# Altium schematic sheet BLDC.SchDoc
size A3
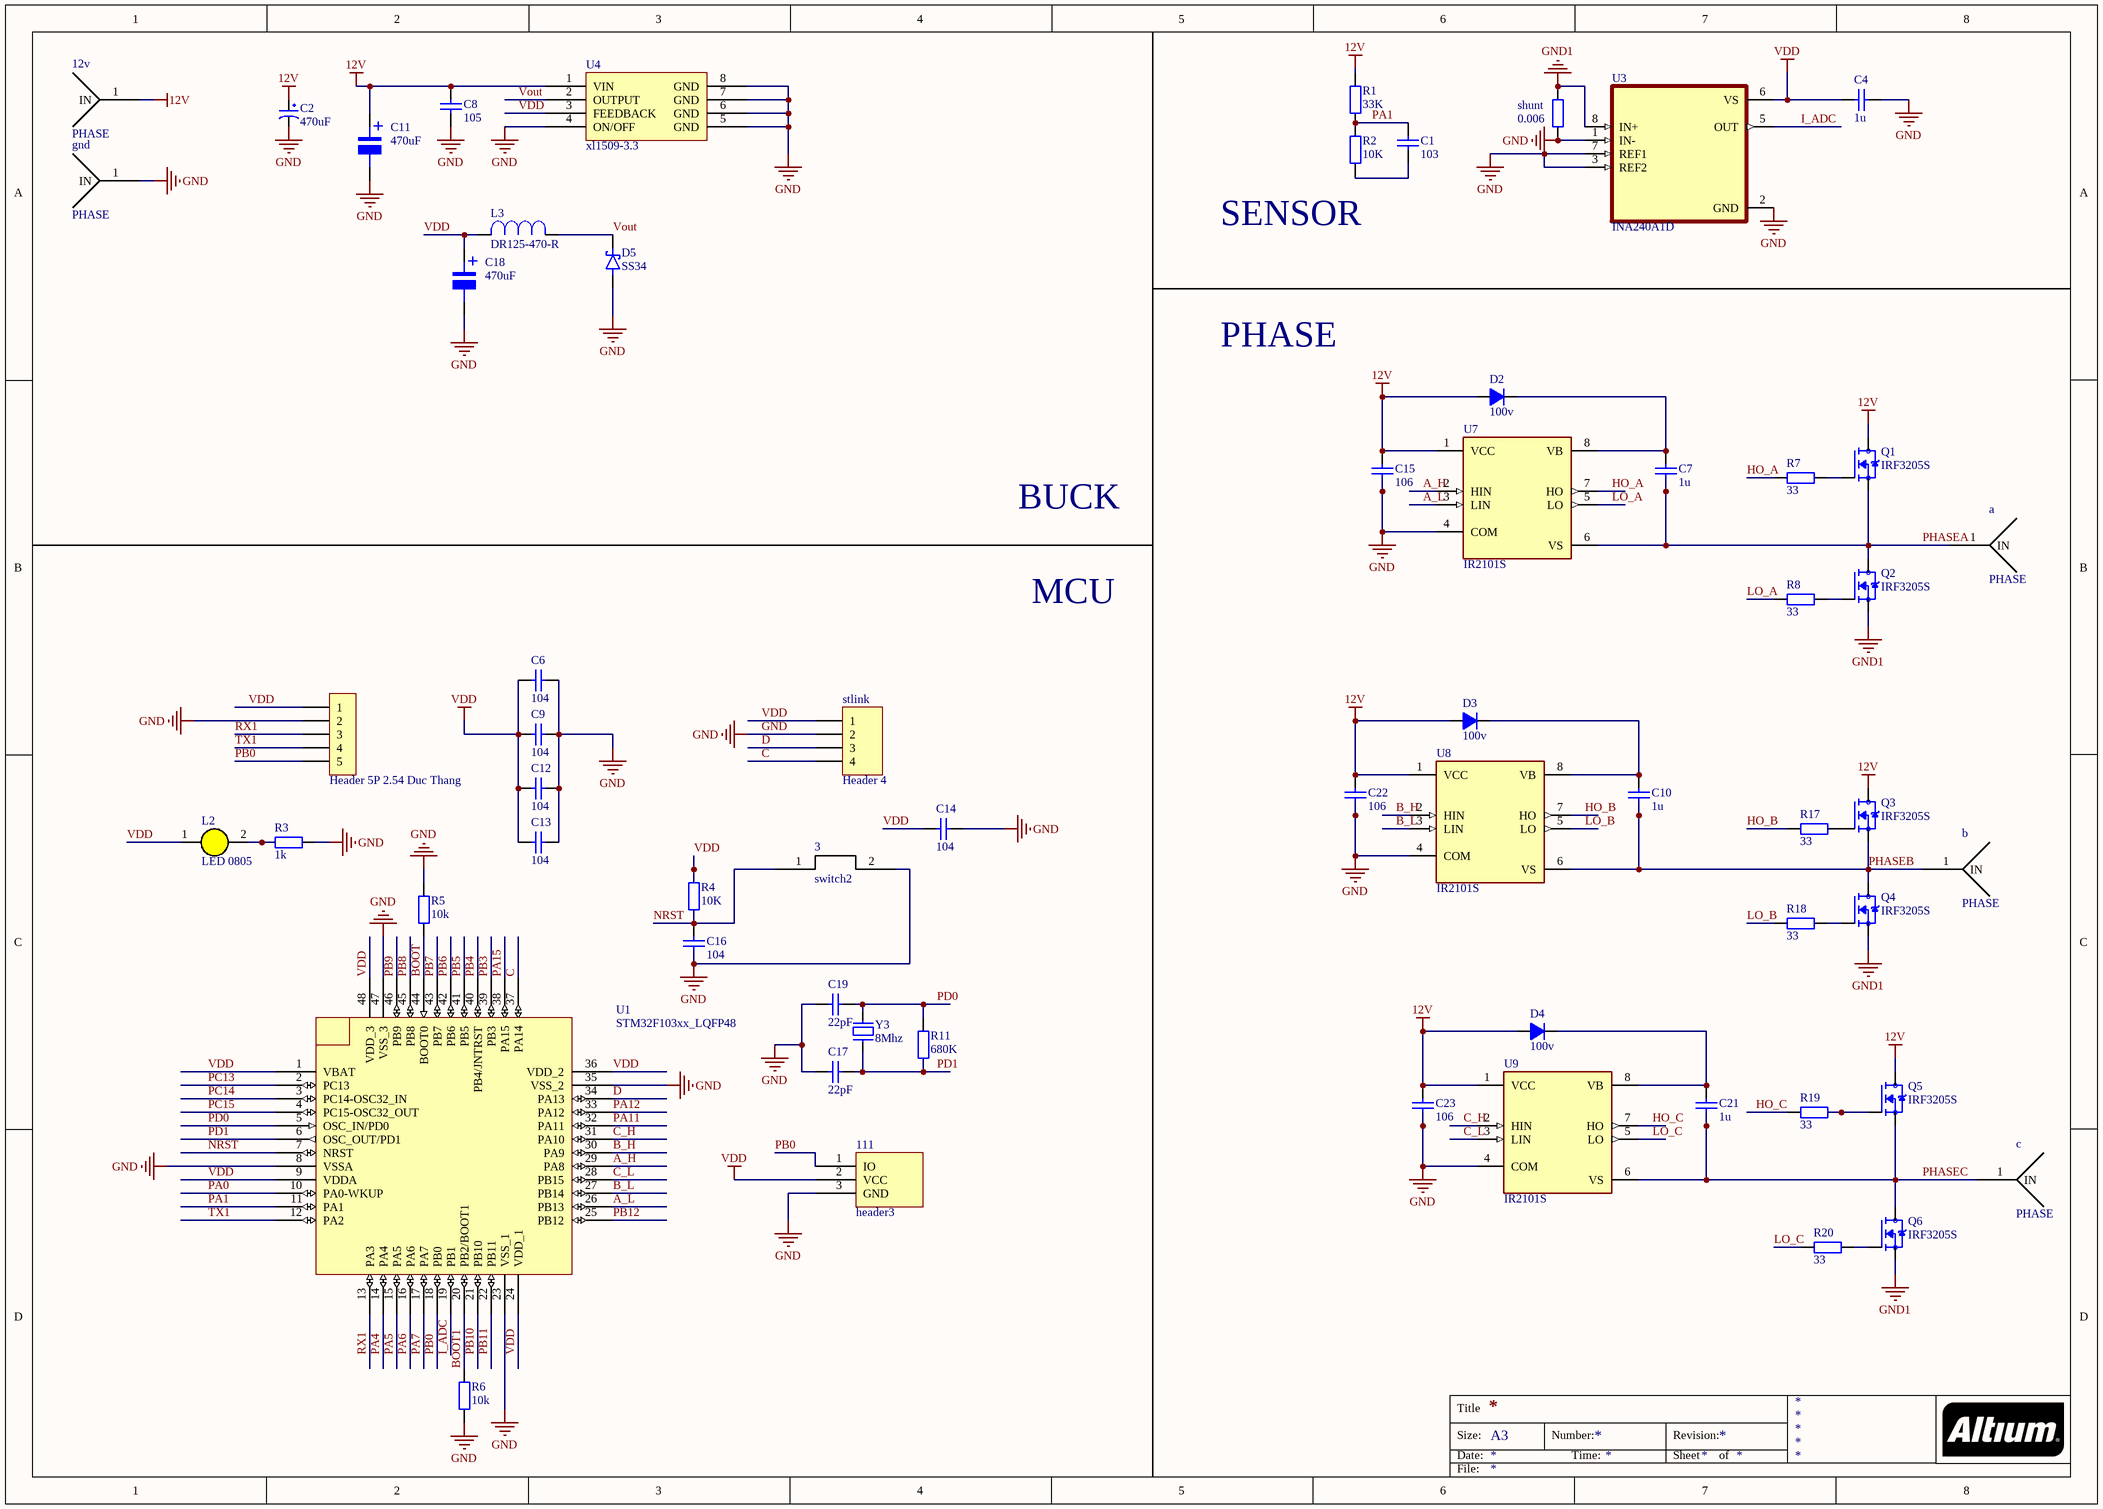
[diagram p0: BLDC.SchDoc]

## Parts
3  switch2  [switch]
12v  PHASE  [PCBComponent_1 - duplicate]
111  header3  [Edge Connector]
a  PHASE  [PCBComponent_1 - duplicate]
b  PHASE  [PCBComponent_1 - duplicate]
c  PHASE  [PCBComponent_1 - duplicate]
C1  103  [tu 0805]
C2  470uF  [TU HOA 10mm]
C4  1u  [tu 0805]
C6  104  [tu 0805]
C7  1u  [tu 0805]
C8  105  [tu 0805]
C9  104  [tu 0805]
C10  1u  [tu 0805]
C11  470uF  [tu nhom 8 (f)]
C12  104  [tu 0805]
C13  104  [tu 0805]
C14  104  [tu 0805]
C15  106  [tu 0805]
C16  104  [tu 0805]
C17  22pF  [tu 0805]
C18  470uF  [tu nhom 8 (f)]
C19  22pF  [tu 0805]
C21  1u  [tu 0805]
C22  106  [tu 0805]
C23  106  [tu 0805]
D2  100v  [DIODE 0.5A]
D3  100v  [DIODE 0.5A]
D4  100v  [DIODE 0.5A]
D5  SS34  [DIOM794X590X250]
gnd  PHASE  [PCBComponent_1 - duplicate]
H1  Header 5P 2.54 Duc Thang  [XH2.54M-5]
L2  LED 0805  [LED-0805-Yellow]
L3  DR125-470-R  [INDM125125X600N]
Q1  IRF3205S  [TRANS_IRF3205S]
Q2  IRF3205S  [TRANS_IRF3205S]
Q3  IRF3205S  [TRANS_IRF3205S]
Q4  IRF3205S  [TRANS_IRF3205S]
Q5  IRF3205S  [TRANS_IRF3205S]
Q6  IRF3205S  [TRANS_IRF3205S]
R1  33K  [tro smd 0805]
R2  10K  [tro smd 0805]
R3  1k  [tro smd 0805]
R4  10K  [tro smd 0805]
R5  10k  [tro smd 0805]
R6  10k  [tro smd 0805]
R7  33  [tro smd 0805]
R8  33  [tro smd 0805]
R11  680K  [tro smd 0805]
R17  33  [tro smd 0805]
R18  33  [tro smd 0805]
R19  33  [tro smd 0805]
R20  33  [tro smd 0805]
shunt  0.006  [PCBComponent_1]
stlink  Header 4  [HDR1X4]
U1  STM32F103xx_LQFP48  [STM32_LQPF48]
U3  INA240A1D  [SOIC127P599X175-8N]
U4  xl1509-3.3  [BUCK-3.3]
U7  IR2101S  [SOIC127P600X175-8N]
U8  IR2101S  [SOIC127P600X175-8N]
U9  IR2101S  [SOIC127P600X175-8N]
Y3  8Mhz  [Thach Anh 2 chan SMD5032]

## Nets
12V: 12v.1(IN) C2.1 C8.1 C11.1 C15.1 C22.1 C23.1 D2.1(A) D3.1(A) D4.1(A) Q1.2(D) Q3.2(D) Q5.2(D) R1.1 U4.1(VIN) U7.1(VCC) U8.1(VCC) U9.1(VCC)
GND: 3.2 111.3(GND) C2.2 C4.2 C6.2 C8.2 C9.2 C11.2 C12.2 C13.2 C14.2 C15.2 C16.1 C17.1 C18.2 C19.2 C22.2 C23.2 D5.A gnd.1(IN) H1.2 R3.2 R5.2 R6.1 shunt.1 stlink.2 U1.8(VSSA) U1.23(VSS_1) U1.35(VSS_2) U1.47(VSS_3) U3.1(IN-) U3.2(GND) U3.3(REF2) U3.7(REF1) U4.4(ON/OFF) U4.5(GND) U4.6(GND) U4.7(GND) U4.8(GND) U7.4(COM) U8.4(COM) U9.4(COM)
GND1: Q2.3(S) Q4.3(S) Q6.3(S) shunt.2 U3.8(IN+)
VDD: 111.2(VCC) C4.1 C6.1 C9.1 C12.1 C13.1 C14.1 C18.1 H1.1 L2.1(A) L3.2 R4.1 stlink.1 U1.1(VBAT) U1.9(VDDA) U1.24(VDD_1) U1.36(VDD_2) U1.48(VDD_3) U3.6(VS) U4.3(FEEDBACK)
A_H: U1.29(PA8) U7.2(HIN)
A_L: U1.26(PB13) U7.3(LIN)
B_H: U1.30(PA9) U8.2(HIN)
B_L: U1.27(PB14) U8.3(LIN)
BOOT: R5.1 U1.44(BOOT0)
BOOT1: R6.2 U1.20(PB2/BOOT1)
C: stlink.4 U1.37(PA14)
C_H: U1.31(PA10) U9.2(HIN)
C_L: U1.28(PB15) U9.3(LIN)
D: stlink.3 U1.34(PA13)
HO_A: R7.1 U7.7(HO)
HO_B: R17.1 U8.7(HO)
HO_C: R19.1 U9.7(HO)
I_ADC: U1.19(PB1) U3.5(OUT)
LO_A: R8.1 U7.5(LO)
LO_B: R18.1 U8.5(LO)
LO_C: R20.1 U9.5(LO)
NRST: 3.1 C16.2 R4.2 U1.7(NRST)
PA0: U1.10(PA0-WKUP)
PA1: C1.1 R1.2 R2.1 U1.11(PA1)
PA4: U1.14(PA4)
PA5: U1.15(PA5)
PA6: U1.16(PA6)
PA7: U1.17(PA7)
PA11: U1.32(PA11)
PA12: U1.33(PA12)
PA15: U1.38(PA15)
PB0: 111.1(IO) H1.5 U1.18(PB0)
PB3: U1.39(PB3)
PB4: U1.40(PB4/JNTRST)
PB5: U1.41(PB5)
PB6: U1.42(PB6)
PB7: U1.43(PB7)
PB8: U1.45(PB8)
PB9: U1.46(PB9)
PB10: U1.21(PB10)
PB11: U1.22(PB11)
PB12: U1.25(PB12)
PC13: U1.2(PC13)
PC14: U1.3(PC14-OSC32_IN)
PC15: U1.4(PC15-OSC32_OUT)
PD0: C19.1 R11.2 U1.5(OSC_IN/PD0) Y3.2
PD1: C17.2 R11.1 U1.6(OSC_OUT/PD1) Y3.1
PHASEA: a.1(IN) C7.2 Q1.3(S) Q2.2(D) U7.6(VS)
PHASEB: b.1(IN) C10.2 Q3.3(S) Q4.2(D) U8.6(VS)
PHASEC: c.1(IN) C21.2 Q5.3(S) Q6.2(D) U9.6(VS)
RX1: H1.3 U1.13(PA3)
TX1: H1.4 U1.12(PA2)
Vout: D5.C L3.1 U4.2(OUTPUT)
NetC1_2: C1.2 R2.2
NetC7_1: C7.1 D2.2(K) U7.8(VB)
NetC10_1: C10.1 D3.2(K) U8.8(VB)
NetC21_1: C21.1 D4.2(K) U9.8(VB)
NetL2_2: L2.2(K) R3.1
NetQ1_1: Q1.1(G) R7.2
NetQ2_1: Q2.1(G) R8.2
NetQ3_1: Q3.1(G) R17.2
NetQ4_1: Q4.1(G) R18.2
NetQ5_1: Q5.1(G) R19.2
NetQ6_1: Q6.1(G) R20.2

## Notes on the sheet
- (near R2) SENSOR
- PHASE
- BUCK
- MCU
- Title
- Size:
- Date:
- A3
- Number:
- Time:
- Revision:
- Sheet
- of
- File:
- (in symbol Tu Nhom 470uF 16V) +

## Library data of the parts
C1 = Tu 0805 22nF 50V 20%: Dán; Don_Vi: Con; So_Chan: 2; Ten_Linh_Kien: Tụ 0805 22nF 50V 20%; Ma_Hang: MH007857; Chung_Loai: Dán; Kieu_Chan: *
C2 = Tu Hoa 470uF 6.3V 8x11: Cắm; Don_Vi: Con; So_Chan: 2; Ten_Linh_Kien: Tụ Hóa 470uF 6.3V 8x11MM; Ma_Hang: MH004511; Chung_Loai: Cắm; Kieu_Chan: *
C4 C6 C9 C12-C17 C22 C23 = Tu 0805 106 16V 10%: Dán; Ten_Linh_Kien: Tụ 0805 106-10uF 10% 16V; So_Chan: 2; Don_Vi: Con; Ma_Hang: MH004553; Chung_Loai: Dán; Kieu_Chan: *
C7 C10 C21 = Tu 0805 10pF 50V 10%: Dán; Don_Vi: Con; So_Chan: 2; Ten_Linh_Kien: Tụ 0805 10P 10% 50V; Ma_Hang: MH004554; Chung_Loai: Dán; Kieu_Chan: *
C8 = Tu 0805 105 50V 10%: Dán; Don_Vi: Con; So_Chan: 2; Ten_Linh_Kien: Tụ 0805 105-1uF 10% 50V; Ma_Hang: MH004552; Chung_Loai: Dán; Kieu_Chan: *
C11 C18 = Tu Nhom 470uF 16V: Dán; Don_Vi: Con; So_Chan: 2; Ten_Linh_Kien: Tụ Nhôm 470uF 16V 8x10.4MM; Ma_Hang: MH001940; Chung_Loai: Dán; Kieu_Chan: *
C19 = Tu 0805 22pF 50V 10%: Dán; Don_Vi: Con; So_Chan: 2; Ten_Linh_Kien: Tụ 0805 22P 10% 50V; Ma_Hang: MH004560; Chung_Loai: Dán; Kieu_Chan: *
D2-D4 = Diode 1N4148: Cắm; Ten_Linh_Kien: Diode 1N4148 DO35 450mA 100V ( 1N4148 DIP); Don_Vi: Con; Ma_Hang: MH001065; Ghi Chu: *; Kieu_Chan: *; Chung_Loai: Cắm
D5 = B320-13-F: Diode Schottky 20V 3A 2Pin SMC | Diodes Inc B320-13-F; MF: Diodes Inc.; SnapEDA_Link: https://www.snapeda.com/parts/B320-13-F/Diodes+Inc./view-part/?ref=snap; Package: DO-214 Diodes Inc.; Value: *; MP: B320-13-F; Check_prices: https://www.snapeda.com/parts/B320-13-F/Diodes+Inc./view-part/?ref=eda
H1 = Header 5P 2.54 Duc Thang: Cắm; Ten_Linh_Kien: Header 5P XH2.54-5P Đực Thẳng; Don_Vi: Con; Ma_Hang: MH001298; Chung_Loai: Cắm
L2 = LED 0805 Vang: Dán; Don_Vi: Con; Ma_Hang: MH002329; Ten_Linh_Kien: LED 0805 Màu Vàng ( Yellow); Ghi_Chu: *; Kieu_Chan: *; Chung_Loai: Dán
L3 = DR125-470-R: Inductor, Wirewound, Shielded, 47uH, 74mOhm, 2.71A, Surface Mount, DR Series | Eaton Electronics DR125-470-R; SnapEDA_Link: https://www.snapeda.com/parts/DR125-470-R/Eaton/view-part/?ref=snap; Package: Non Standard Coiltronics / Eaton; Value: *; MF: Eaton; MP: DR125-470-R; Check_prices: https://www.snapeda.com/parts/DR125-470-R/Eaton/view-part/?ref=eda
Q1-Q6 = IRF3205S: N-Channel 55 V 110A (Tc) 200W (Tc) Surface Mount D2PAK; MF: Infineon Technologies; SnapEDA_Link: https://www.snapeda.com/parts/IRF3205S/Infineon+Technologies/view-part/?ref=snap; Check_prices: https://www.snapeda.com/parts/IRF3205S/Infineon+Technologies/view-part/?ref=eda; MP: IRF3205S; Availability: Not in stock; Package: D2PAK Infineon / IR; Price: None; Value: *
R1-R4 R11 = Tro 0805 5% 1M: Dán; Don_Vi: Con; So_Chan: 2; Ten_Linh_Kien: Trở 0805 5% 1M; Ma_Hang: MH005235; Chung_Loai: Dán; Kieu_Chan: *
R5-R8 R17-R20 = Tro 0805 1% 0.22R: Dán; Don_Vi: Con; So_Chan: 2; Ten_Linh_Kien: Trở 0805 1% 0.22R; Ma_Hang: MH005466; Chung_Loai: Dán; Kieu_Chan: *
shunt = tro shunt: cam; Chung_Loai: Dán; Don_Vi: Con; So_Chan: 2; Ten_Linh_Kien: Trở 0805 1% 0.22R; Ma_Hang: MH005466; Kieu_Chan: *
stlink = Header 4: Header, 4-Pin; LatestRevisionDate: 17-Jul-2002; LatestRevisionNote: Re-released for DXP Platform.; Publisher: Altium Limited
U3 = INA240A1D: -4 to 80V, bidirectional, ultra-precise current sense amplifier with enhanced PWM rejection; MF: Texas Instruments; SnapEDA_Link: https://www.snapeda.com/parts/INA240A1D/Texas+Instruments/view-part/?ref=snap; Package: SOIC-8 Texas Instruments; Value: *; MP: INA240A1D; Check_prices: https://www.snapeda.com/parts/INA240A1D/Texas+Instruments/view-part/?ref=eda
U7-U9 = IR2101S: Half-Bridge Gate Driver IC Non-Inverting 8-SOIC; MF: Infineon Technologies; SnapEDA_Link: https://www.snapeda.com/parts/IR2101S/Infineon/view-part/?ref=snap; Package: SOIC-8 Infineon; Value: *; MP: IR2101S; Check_prices: https://www.snapeda.com/parts/IR2101S/Infineon/view-part/?ref=eda
Y3 = Thach Anh 2 chan SMD 5032: Crystal For all Crystal 2pin.; Value: 4Mhz
U1 = STM32F103xx_LQFP48: Published: 30-May-2008; DatasheetVersion: rev6, Mar-2008; PackageVersion: Mar-2008; PackageReference: LQFP48; Publisher: Altium Limited; PackageDescription: 48-Pin Low-Profile Quad Flat Pack, 7 x 7 mm Body, 0.5 mm Pitch (LQFP48); ComponentLink1Description: Manufacturer Link; ComponentLink1URL: www.st.com/stm32; ComponentLink2Description: Datasheet; ComponentLink2URL: http://www.st.com/stonline/products/literature/ds/13587.pdf